# EAGLE design BlindAidRing (EAGLE 9.6.2)
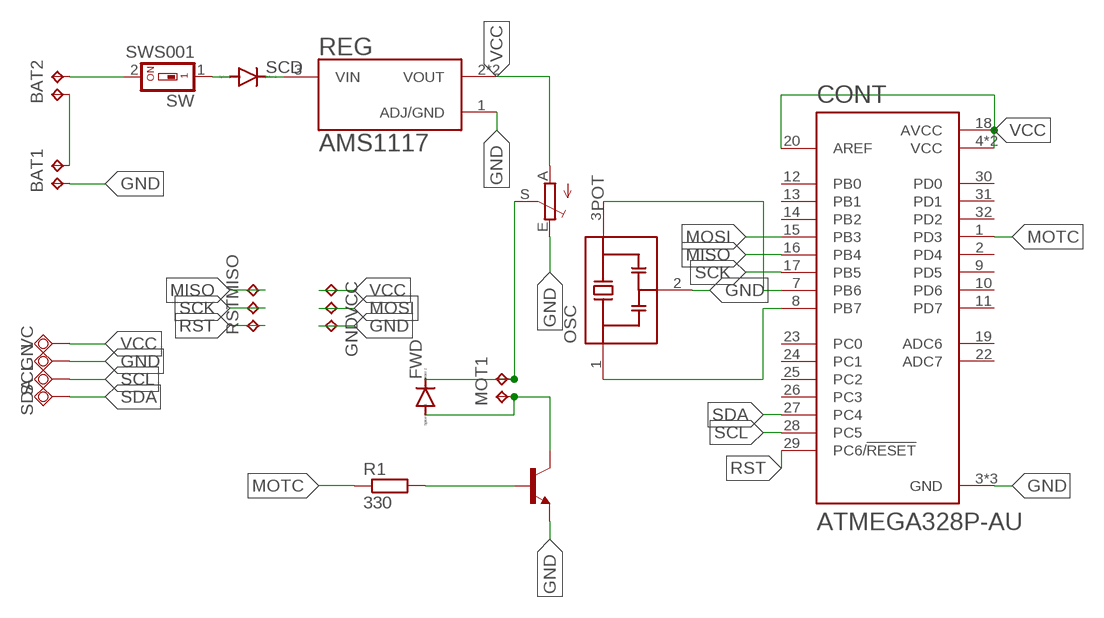
[diagram p0: schematic, sheet 1]

## Parts
BAT1  TPTP20SQ  [TP20SQ]
BAT2  TPTP20SQ  [TP20SQ]
BAT11  TPTP20SQ  [TP20SQ]
BAT22  TPTP20SQ  [TP20SQ]
CONT  ATMEGA328P-AU  [QFP80P900X900X120-32N]
FWD  CGRM4002-G  [SOD-123_MINI-SMA]
GN  TPSQTP18SQ  [TP18SQ]
GND  TPB1,27  [B1,27]
MISO  TPB1,27  [B1,27]
MOSI  TPB1,27  [B1,27]
MOT1  TPTP20SQ  [TP20SQ]
MOT2  TPTP20SQ  [TP20SQ]
OSC  CSTCE16M0V53-R0  [OSC_CSTCE16M0V53-R0]
POT  TRIM_EU-CA6V  [CA6V]
R1  330  R-EU_R0603  [R0603]
REG  AMS1117  [SOT229P700X180-4N]
RST  TPB1,27  [B1,27]
SCD  CGRM4002-G  [SOD-123_MINI-SMA]
SCK  TPB1,27  [B1,27]
SCL  TPSQTP18SQ  [TP18SQ]
SDA  TPSQTP18SQ  [TP18SQ]
SW  SWS001  [SMS-001]
T1  -NPN-SOT23-EBC  [SOT23-EBC]
VC  TPSQTP18SQ  [TP18SQ]
VCC  TPB1,27  [B1,27]

## Nets
GND: BAT1.TP CONT.3(GND) CONT.5(GND) CONT.21(GND) GN.TP GND.TP OSC.2(GND) POT.E REG.1(ADJ/GND) T1.E
MISO: CONT.16(PB4) MISO.TP
MOSI: CONT.15(PB3) MOSI.TP
MOTC: CONT.1(PD3) R1.1
N$1: FWD.C MOT2.TP POT.S
N$2: FWD.A MOT1.TP T1.C
N$3: BAT22.TP SW.2
N$4: R1.2 T1.B
N$5: BAT2.TP BAT11.TP
N$7: REG.3(VIN) SCD.C
N$9: SCD.A SW.1
N$10: CONT.7(PB6) OSC.3(OUT)
N$11: CONT.8(PB7) OSC.1(IN)
RST: CONT.29(PC6/!RESET) RST.TP
SCK: CONT.17(PB5) SCK.TP
SCL: CONT.28(PC5) SCL.TP
SDA: CONT.27(PC4) SDA.TP
VCC: CONT.4(VCC) CONT.6(VCC) CONT.18(AVCC) CONT.20(AREF) POT.A REG.2(VOUT) REG.4(VOUT) VC.TP VCC.TP
Unconnected: CONT.2(PD4) CONT.9(PD5) CONT.10(PD6) CONT.11(PD7) CONT.12(PB0) CONT.13(PB1) CONT.14(PB2) CONT.19(ADC6) CONT.22(ADC7) CONT.23(PC0) CONT.24(PC1) CONT.25(PC2) CONT.26(PC3) CONT.30(PD0) CONT.31(PD1) CONT.32(PD2)

## Library data of the parts
BAT1 BAT2 BAT11 BAT22 GND MISO MOSI MOT1 MOT2 RST SCK VCC = testpad:TP: Test pad
CONT = ATMEGA328P-AU:ATMEGA328P-AU: ATmega Series 20 MHz 32 KB Flash 2 KB SRAM 8-Bit Microcontroller - TQFP-32 Check prices <https://pricing.snapeda.com/parts/ATMEGA328P-AU/Microchip%20Technology/view-part?ref=eda>; AVAILABILITY: In Stock; DESCRIPTION: AVR AVR® ATmega Microcontroller IC 8-Bit 20MHz 32KB (16K x 16) FLASH 32-TQFP (7x7); MF: Microchip Technology; MP: ATMEGA328P-AU; PACKAGE: TQFP-32 Microchip; PRICE: None; PURCHASE-URL: https://pricing.snapeda.com/search/part/ATMEGA328P-AU/?ref=eda
FWD SCD = diode:CGRM400*-G: Molded plasitc,JEDEC SOD-123/Mini SMA Source: Comchip CGRM4001-G.pdf
GN SCL SDA VC = testpad:TPSQ: Test pad
OSC = CSTCE16M0V53-R0:CSTCE16M0V53-R0: 20MHz Ceramic Resonator Built in Capacitor 15pF +/- 0.2% -40C - 125C Surface Mount Check prices <https://pricing.snapeda.com/parts/CSTCE16M0V53-R0/Murata/view-part?ref=eda>; AVAILABILITY: In Stock; DESCRIPTION: 16 MHz Ceramic Resonator Built in Capacitor 15 pF ±0.3% -20°C ~ 80°C Surface Mount; MF: Murata; MP: CSTCE16M0V53-R0; PACKAGE: SMD-3 Murata; PRICE: None
POT = MIA_LIBRARY-2-2-2:TRIM_EU-: POTENTIOMETER
R1 = rcl:R-EU_: RESISTOR, European symbol; SPICEPREFIX: R
REG = AMS1117:AMS1117: Sot223/Pkg 1-Amp 5-Volt Low Drop Out Voltage Regulatator Check prices <https://pricing.snapeda.com/parts/AMS1117/Advanced%20Monolithic%20Systems/view-part?ref=eda>; AVAILABILITY: In Stock; DESCRIPTION: 1A LOW DROPOUT VOLTAGE REGULATOR SOT-223; MF: Advanced Monolithic Systems; MP: AMS1117; PACKAGE: SOT-223 Seeed Technology; PRICE: None
SW = smd-special:SWS001: SMD Dip Switch 1 pol.
T1 = transistor-neu-to92:*-NPN-: NPN Transistror

## Board
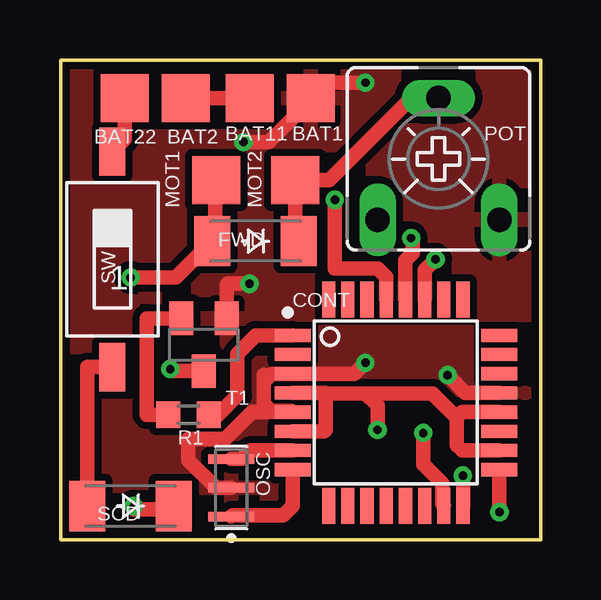
[diagram p1: board, top side]
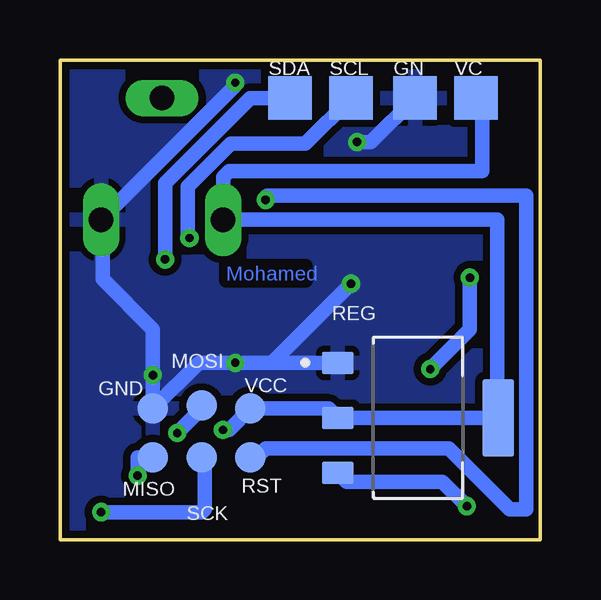
[diagram p2: board, bottom side, seen from below]

Size 20 x 20 mm. Coordinates in mm from the lower left corner, seen from the top.
Outline: 0,0 0,20 20,20 20,0 0,0
Copper layers (1*16): Top 0.035mm / dielectric 1.5mm / Bottom 0.035mm
Design rules "default *": minimum track width 0.5mm, minimum drill 0.35mm, track to track 6mil, track to pad 6mil, pad to pad 6mil, via to via 6mil, smd to smd 6mil, copper to edge 0.2mm, drill to drill 0.2mm, minimum pad ring 10mil, minimum via ring 8mil, stop-mask expansion 4mil, vias tented up to drill 0mil, thermal gap 10mil

### Footprints (pad centres in the part's own frame; a part is rotated, then mirrored left to right if it is on the bottom)
TP20SQ = smd 2 x 2: TP 0,0
QFP80P900X900X120-32N = smd 1.5 x 0.55: 1 -4.3,2.8; 2 -4.3,2; 3 -4.3,1.2; 4 -4.3,0.4; 5 -4.3,-0.4; 6 -4.3,-1.2; 7 -4.3,-2; 8 -4.3,-2.8; 17 4.3,-2.8; 18 4.3,-2; 19 4.3,-1.2; 20 4.3,-0.4; 21 4.3,0.4; 22 4.3,1.2; 23 4.3,2; 24 4.3,2.8 | smd 0.55 x 1.5: 9 -2.8,-4.3; 10 -2,-4.3; 11 -1.2,-4.3; 12 -0.4,-4.3; 13 0.4,-4.3; 14 1.2,-4.3; 15 2,-4.3; 16 2.8,-4.3; 25 2.8,4.3; 26 2,4.3; 27 1.2,4.3; 28 0.4,4.3; 29 -0.4,4.3; 30 -1.2,4.3; 31 -2,4.3; 32 -2.8,4.3
SOD-123_MINI-SMA = smd 1.5 x 2.1: A 1.8,0; C -1.8,0
TP18SQ = smd 1.8 x 1.8: TP 0,0
B1,27 = smd 1.27 x 1.27: TP 0,0
OSC_CSTCE16M0V53-R0 = smd 0.4 x 1.9: 1 -1.2,0; 2 0,0; 3 1.2,0
CA6V = drill 1.016 long: A -2.54,-2.54; E 2.54,-2.54; S 0,2.54
R0603 = smd 1 x 1.1: 1 -0.85,0; 2 0.85,0
SOT229P700X180-4N = smd 1.31 x 0.93: 1 -3.345,2.29; 2 -3.345,0; 3 -3.345,-2.29 | smd 1.31 x 3.24: 4 3.345,0
SMS-001 = smd 1.092 x 2.007: 1 0,-4.496; 2 0,4.496
SOT23-EBC = smd 1 x 1.4: B 0.95,-1.1; C 0,1.1; E -0.95,-1.1

### Placement (x,y rotation side)
BAT1  10.41,18.41 0 top
BAT2  5.21,18.41 0 top
BAT11  7.87,18.41 0 top
BAT22  2.67,18.41 0 top
CONT  13.97,5.71 0 top
FWD  8.13,12.45 180 top
GN  5.21,18.41 0 bottom
GND  16.13,5.46 0 bottom
MISO  16.13,3.43 0 bottom
MOSI  14.1,5.59 0 bottom
MOT1  6.48,14.99 0 top
MOT2  9.78,14.99 0 top
OSC  7.11,2.16 90 top
POT  15.75,15.88 0 top
R1  5.33,5.21 180 top
REG  5.08,5.08 0 bottom
RST  12.06,3.43 0 bottom
SCD  2.92,1.4 180 top
SCK  14.1,3.43 0 bottom
SCL  7.87,18.41 0 bottom
SDA  10.41,18.41 0 bottom
SW  2.16,11.68 0 top
T1  5.97,8.13 180 top
VC  2.67,18.41 0 bottom
VCC  12.06,5.46 0 bottom

### Tracks (layer width: path | path; a pad name or v marks a point on that pad's centre or on a via)
GND  (via drill 0.35)
  Top 0.6: CONT.21 16.87,6.12 v16.13,6.86 | T1.E 6.92,10.62 6.96,10.67 v7.87,10.67 | 8.47,6.58 8.47,5.65 8.76,5.36 9.62,5.36 CONT.5 7.98,5.32 6.87,4.21 5.33,4.21 5.33,3.31 6.48,2.16 OSC.2 | 8.47,6.58 8.47,6.86 | 8.47,6.58 8.8,6.92 CONT.3 12.24,6.92 v12.7,7.37 | v7.62,16.58 8.68,16.58 10.41,18.32 BAT1.TP 10.16,18.67 10.16,19.05 v12.7,19.05
  Bottom 0.6: REG.1 11.17,7.37 | 11.17,7.37 v12.7,7.37 14.22,7.37 GND.TP v16.13,6.86 16.13,8.76 18.22,10.86 18.22,13.27 POT.E 12.7,18.92 v12.7,19.05 | v7.87,10.67 11.17,7.37 | GN.TP 7.04,16.58 v7.62,16.58
  pour Bottom (isolate 0.305): 20.32,20.32 20.32,0 20.32,-1.27 -1.27,-1.27 -1.27,20.32
  pour Top (isolate 0.305): 0,21.59 21.59,21.59 21.59,-1.27 -2.54,-1.27 -2.54,21.59
MISO  (via drill 0.35)
  Top 0.6: CONT.16 v16.77,2.66 v16.76,2.67
  Bottom 0.6: MISO.TP 16.76,3.43 v16.76,2.67
MOSI  (via drill 0.35)
  Top 0.6: CONT.15 15.9,1.49 15.9,2.35 15.11,3.14 v15.11,4.45
  Bottom 0.6: v15.11,4.45 14.1,5.46 MOSI.TP
MOTC
  Top 0.6: R1.1 6.57,5.21 7.37,6.01 7.37,7.75 8.13,8.52 CONT.1
N$1
  Top 0.6: FWD.C 9.78,12.6 MOT2.TP 11.08,14.99 11.09,15 11.19,15 14.61,18.41 POT.S
N$2  (via drill 0.35)
  Top 0.6: T1.C 4.66,7.03 v4.57,7.11 | MOT1.TP 6.46,14.96 6.46,12.57 FWD.A 4.8,10.92 v2.92,10.92
  Bottom 0.6: v4.57,7.11 2.92,8.76 v2.92,10.92
N$3
  Top 0.6: SW.2 2.67,16.69 BAT22.TP
N$4
  Top 0.6: R1.2 3.6,5.21 3.6,9.23 T1.B
N$5
  Top 0.6: BAT2.TP BAT11.TP
N$7  (via drill 0.35)
  Top 0.6: v3.05,1.4 3.05,1.27 4.85,1.27 SCD.C
  Bottom 0.6: REG.3 8.05,2.41 7.62,2.41 6.35,2.41 4.06,2.41 v3.05,1.4
N$9
  Top 0.6: SCD.A 1.12,7.19 SW.1
N$10
  Top 0.6: OSC.3 7.55,3.36 7.91,3.71 CONT.7
N$11
  Top 0.6: CONT.8 9.67,1.42 9.27,1.02 7.17,1.02 OSC.1
RST  (via drill 0.35)
  Top 0.6: CONT.29 13.57,10.94 13.21,11.3 11.43,11.3 v11.43,14.17
  Bottom 0.6: RST.TP 11.81,3.43 11.43,3.81 3.81,3.81 1.27,1.27 0.58,1.27 0.58,14.35 11.36,14.35 11.36,14.23 11.37,14.23 | 11.4,14.26 11.37,14.23 | 11.37,14.23 v11.43,14.17
SCK  (via drill 0.35)
  Top 0.6: v18.29,1.14 18.27,1.16 CONT.17
  Bottom 0.6: SCK.TP 13.97,3.3 13.97,1.27 14.1,1.14 v18.29,1.14
SCL  (via drill 0.35)
  Top 0.6: CONT.28 14.37,11.64 14.68,11.94 14.68,12.5 v14.61,12.57
  Bottom 0.6: v14.61,12.57 14.68,12.64 14.68,14.71 12.88,16.5 9.79,16.5 SCL.TP
SDA  (via drill 0.35)
  Top 0.6: CONT.27 15.17,11.23 v15.62,11.68
  Bottom 0.6: v15.62,11.68 15.62,14.86 12.06,18.41 SDA.TP
VCC  (via drill 0.35)
  Top 0.6: CONT.20 16.75,5.32 16.51,5.08 | 16.51,5.08 16.51,3.94 16.73,3.71 CONT.18 | CONT.6 10.99,4.51 11.05,4.57 11.05,6.1 | 11.05,6.1 11.03,6.12 CONT.4 | 11.05,6.1 12.7,6.1 | 12.7,6.1 15.49,6.1 16.51,5.08 | 12.7,6.1 13.21,5.59 v13.21,4.57
  Bottom 0.6: v13.21,4.57 12.95,4.57 VCC.TP 8.81,5.46 REG.2 REG.4 1.78,5.12 1.78,13.34 POT.A 13.21,15.11 12.95,15.37 2.41,15.37 2.41,18.16 VC.TP

### Text on the board
Bottom: Mohamed